# Altium schematic sheet schematics.SchDoc
size A4; SheetNumber: 1; SheetTotal: 1
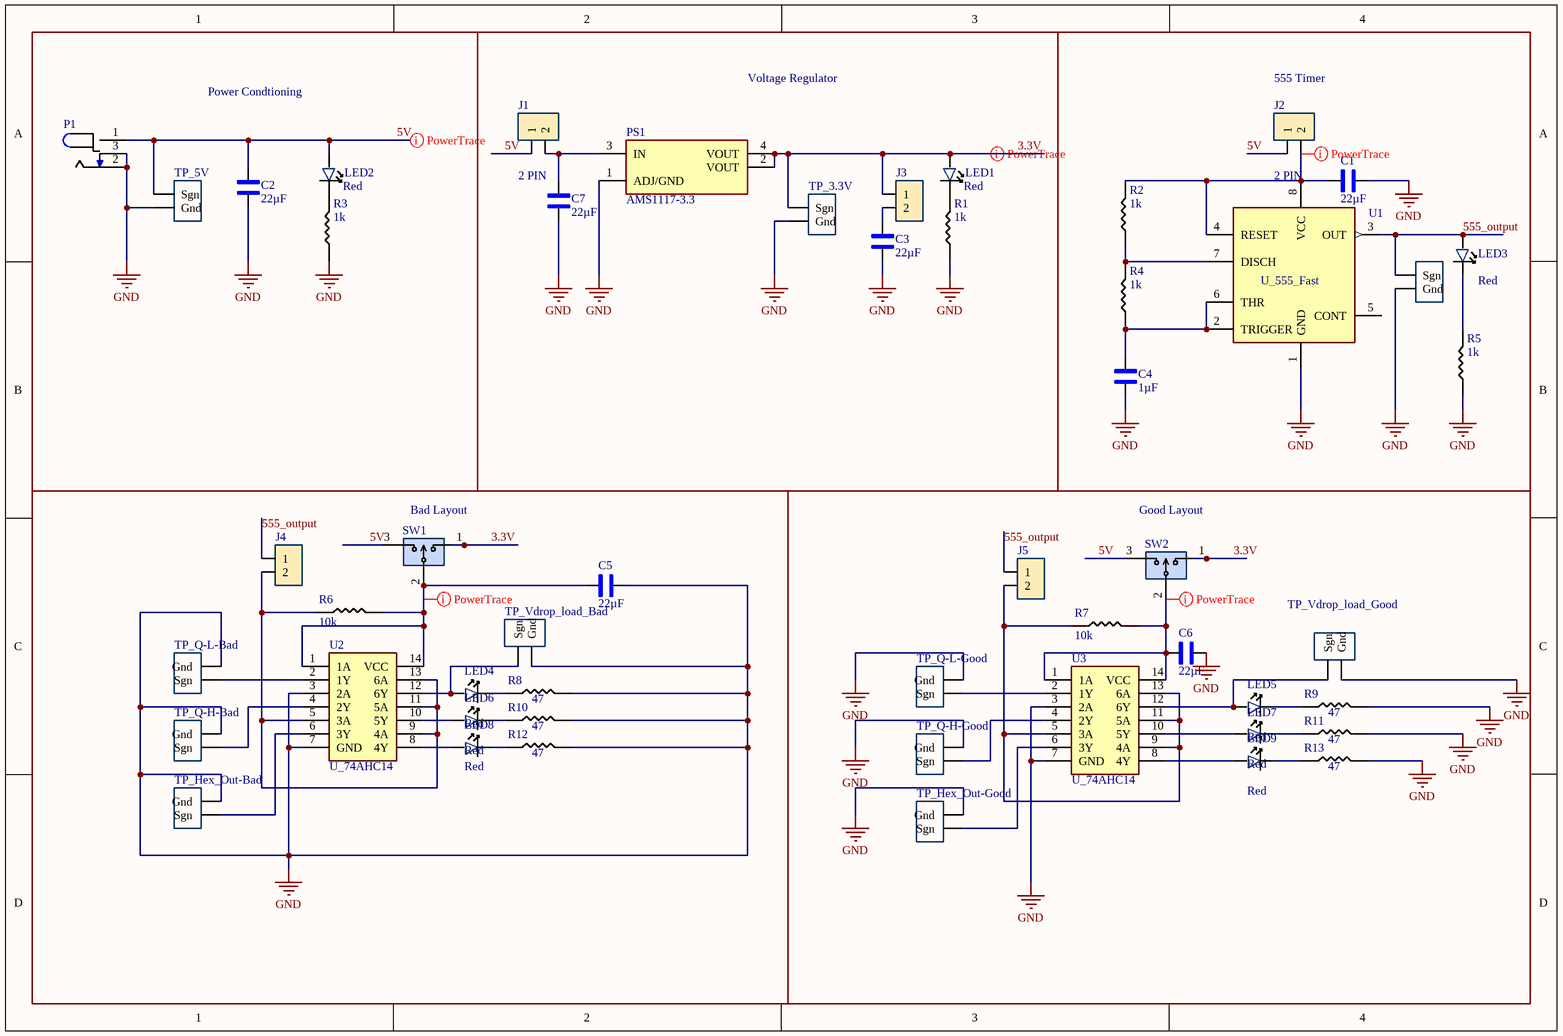
[diagram p0: schematics.SchDoc]

## Parts
C1  value 22µF  [1206_Passive_Capacitor]  (hidden comment: C_22uF_1206)
C2  value 22µF  [1206_Passive_Capacitor]  (hidden comment: C_22uF_1206)
C3  value 22µF  [1206_Passive_Capacitor]  (hidden comment: C_22uF_1206)
C4  value 1µF  [1206_Passive_Capacitor]  (hidden comment: C_1uF_1206)
C5  value 22µF  [1206_Passive_Capacitor]  (hidden comment: C_22uF_1206)
C6  value 22µF  [1206_Passive_Capacitor]  (hidden comment: C_22uF_1206)
C7  value 22µF  [1206_Passive_Capacitor]  (hidden comment: C_22uF_1206)
J1  value 2 PIN  [2_PIN_100MIL]  (hidden comment: JM_2_PIN_MALE)
J2  value 2 PIN  [2_PIN_100MIL]  (hidden comment: JM_2_PIN_MALE)
J3  JM_2_PIN_MALE  [2_PIN_100MIL]  (value not drawn)
J4  JM_2_PIN_MALE  [2_PIN_100MIL]  (value not drawn)
J5  JM_2_PIN_MALE  [2_PIN_100MIL]  (value not drawn)
LED1  value Red  [LED_1206]  (hidden comment: LED_RED_1206)
LED2  value Red  [LED_1206]  (hidden comment: LED_RED_1206)
LED3  value Red  [LED_1206]  (hidden comment: LED_RED_1206)
LED4  value Red  [LED_1206]  (hidden comment: LED_RED_1206)
LED5  value Red  [LED_1206]  (hidden comment: LED_RED_1206)
LED6  value Red  [LED_1206]  (hidden comment: LED_RED_1206)
LED7  value Red  [LED_1206]  (hidden comment: LED_RED_1206)
LED8  value Red  [LED_1206]  (hidden comment: LED_RED_1206)
LED9  value Red  [LED_1206]  (hidden comment: LED_RED_1206)
P1  P_Power Jack  [Power_Jack]  (value not drawn)
PS1  MFR Part #: AMS1117-3.3  [LDO]  (hidden comment: PS_AMS_LDO_3v3)
R1  value 1k  [1206_Passive_Resitor]  (hidden comment: R_1K_1206)
R2  value 1k  [1206_Passive_Resitor]  (hidden comment: R_1K_1206)
R3  value 1k  [1206_Passive_Resitor]  (hidden comment: R_1K_1206)
R4  value 1k  [1206_Passive_Resitor]  (hidden comment: R_1K_1206)
R5  value 1k  [1206_Passive_Resitor]  (hidden comment: R_1K_1206)
R6  value 10k  [1206_Passive_Resitor]  (hidden comment: R_10KOhm_1206)
R7  value 10k  [1206_Passive_Resitor]  (hidden comment: R_10KOhm_1206)
R8  value 47  [1206_Passive_Resitor]  (hidden comment: R_47Ohm_1206)
R9  value 47  [1206_Passive_Resitor]  (hidden comment: R_47Ohm_1206)
R10  value 47  [1206_Passive_Resitor]  (hidden comment: R_47Ohm_1206)
R11  value 47  [1206_Passive_Resitor]  (hidden comment: R_47Ohm_1206)
R12  value 47  [1206_Passive_Resitor]  (hidden comment: R_47Ohm_1206)
R13  value 47  [1206_Passive_Resitor]  (hidden comment: R_47Ohm_1206)
SW1  SW_3Pin_100mil_Switch  [3_PIN_100mil]  (value not drawn)
SW2  SW_3Pin_100mil_Switch  [3_PIN_100mil]  (value not drawn)
TP_3.3V  TP_10x_Probe  [TP10x_Probe]  (value not drawn)
TP_5V  TP_10x_Probe  [TP10x_Probe]  (value not drawn)
TP_555_output  TP_10x_Probe  [TP10x_Probe]  (value not drawn)
TP_Hex_Out-Bad  TP_10x_Probe  [TP10x_Probe]  (value not drawn)
TP_Hex_Out-Good  TP_10x_Probe  [TP10x_Probe]  (value not drawn)
TP_Q-H-Bad  TP_10x_Probe  [TP10x_Probe]  (value not drawn)
TP_Q-H-Good  TP_10x_Probe  [TP10x_Probe]  (value not drawn)
TP_Q-L-Bad  TP_10x_Probe  [TP10x_Probe]  (value not drawn)
TP_Q-L-Good  TP_10x_Probe  [TP10x_Probe]  (value not drawn)
TP_Vdrop_load_Bad  TP_10x_Probe  [TP10x_Probe]  (value not drawn)
TP_Vdrop_load_Good  TP_10x_Probe  [TP10x_Probe]  (value not drawn)
U1  U_555_Fast  [TS555IDTTR]
U2  U_74AHC14  [HEX_74AC14]
U3  U_74AHC14  [HEX_74AC14]

## Blocks framed on the sheet
Power Condtioning: C2 LED2 P1 R3 TP_5V
Voltage Regulator: C3 C7 J1 J3 LED1 PS1 R1 TP_3.3V
555 Timer: C1 C4 J2 LED3 R2 R4 R5 TP_555_output U1
Bad Layout: C5 J4 LED4 LED6 LED8 R6 R8 R10 R12 SW1 TP_Hex_Out-Bad TP_Q-H-Bad TP_Q-L-Bad TP_Vdrop_load_Bad U2
Good Layout: C6 J5 LED5 LED7 LED9 R7 R9 R11 R13 SW2 TP_Hex_Out-Good TP_Q-H-Good TP_Q-L-Good TP_Vdrop_load_Good U3

## Nets
GND: C1.2 C2.1 C3.2 C4.1 C5.1 C6.1 C7.2 P1.2 P1.3 PS1.1(ADJ/GND) R1.1 R3.1 R5.1 R8.2 R9.2 R10.2 R11.2 R12.2 R13.2 TP_3.3V.2(Gnd) TP_5V.2(Gnd) TP_555_output.2(Gnd) TP_Hex_Out-Bad.2(Gnd) TP_Hex_Out-Good.2(Gnd) TP_Q-H-Bad.2(Gnd) TP_Q-H-Good.2(Gnd) TP_Q-L-Bad.2(Gnd) TP_Q-L-Good.2(Gnd) TP_Vdrop_load_Bad.2(Gnd) TP_Vdrop_load_Good.2(Gnd) U1.1(GND) U2.3(2A) U2.7(GND) U3.3(2A) U3.7(GND)
3.3V: J3.1 LED1.1 PS1.2(VOUT) PS1.4(VOUT) SW1.1 SW2.1 TP_3.3V.1(Sgn)
5V: C2.2 J1.1 J2.1 LED2.1 P1.1 SW1.3 SW2.3 TP_5V.1(Sgn)
555_output: J4.1 J5.1 LED3.1 TP_555_output.1(Sgn) U1.3(OUT)
NetC1_1: C1.1 J2.2 R2.2 U1.4(RESET) U1.8(VCC)
NetC3_1: C3.1 J3.2
NetC4_2: C4.2 R4.1 U1.2(TRIGGER) U1.6(THR)
NetC5_2: C5.2 R6.2 SW1.2 U2.1(1A) U2.14(VCC)
NetC6_2: C6.2 R7.2 SW2.2 U3.1(1A) U3.14(VCC)
NetC7_1: C7.1 J1.2 PS1.3(IN)
NetJ4_2: J4.2 R6.1 U2.5(3A) U2.9(4A) U2.11(5A) U2.13(6A)
NetJ5_2: J5.2 R7.1 U3.5(3A) U3.9(4A) U3.11(5A) U3.13(6A)
NetLED1_2: LED1.2 R1.2
NetLED2_2: LED2.2 R3.2
NetLED3_2: LED3.2 R5.2
NetLED4_1: LED4.1 TP_Vdrop_load_Bad.1(Sgn) U2.12(6Y)
NetLED4_2: LED4.2 R8.1
NetLED5_1: LED5.1 TP_Vdrop_load_Good.1(Sgn) U3.12(6Y)
NetLED5_2: LED5.2 R9.1
NetLED6_1: LED6.1 U2.10(5Y)
NetLED6_2: LED6.2 R10.1
NetLED7_1: LED7.1 U3.10(5Y)
NetLED7_2: LED7.2 R11.1
NetLED8_1: LED8.1 U2.8(4Y)
NetLED8_2: LED8.2 R12.1
NetLED9_1: LED9.1 U3.8(4Y)
NetLED9_2: LED9.2 R13.1
NetR2_1: R2.1 R4.2 U1.7(DISCH)
NetTP_Hex_Out-Bad_1: TP_Hex_Out-Bad.1(Sgn) U2.6(3Y)
NetTP_Hex_Out-Good_1: TP_Hex_Out-Good.1(Sgn) U3.6(3Y)
NetTP_Q-H-Bad_1: TP_Q-H-Bad.1(Sgn) U2.4(2Y)
NetTP_Q-H-Good_1: TP_Q-H-Good.1(Sgn) U3.4(2Y)
NetTP_Q-L-Bad_1: TP_Q-L-Bad.1(Sgn) U2.2(1Y)
NetTP_Q-L-Good_1: TP_Q-L-Good.1(Sgn) U3.2(1Y)

Not connected (* = marked no-connect by the designer): U1 5(CONT)

## Layout directives
rule Width Constraint [Pref Width = 20mil    Min Width = 10mil    Max Width = 100mil]: 3.3V, 5V, NetC1_1, NetC5_2, NetC6_2

## Library data of the parts
C1-C3 C5-C7 = CMP-001-00089-1: 22uF ±10% 25V X5R 1206 Multilayer Ceramic Capacitors MLCC - SMD/SMT RoHS; MFR Part #: CL31A226KAHNNNE; Type: basic; Design Item ID: C_22uF_1206; Datasheet: https://datasheet.lcsc.com/lcsc/1811031514_Samsung-Electro-Mechanics-CL31A226KAHNNNE_C12891.pdf; LCSC Part#: C12891; Component Type: Standard; Pins: 2; Source: ECEN5730Lib_2023_05_DS.SchLib
C4 = CMP-001-00086-1: MULTILAYER CERAMIC CAPACITORS MLCC - SMD/SMT 1UF 50V 1206 ROHS; MFR Part #: CL31B105KBHNNNE; Type: Basic; Source: ECEN5730Lib_2023_05_DS.SchLib; Digikey Link: https://www.digikey.com/product-detail/en/C1206C105M4RACTU/399-8150-1-ND/3471873/?itemSeq=304982366; Pins: 2; Design Item ID: C_1uF_1206; LCSC Part#: C1848; Component Type: Standard
J1 J2 = CMP-002-00089-1: 2.54mm Straight 2 1 Header,Breakaway Through Hole,P=2.54mm Pin Header & Female Header ROHS; MFR Part #: B-2100S02P-A110; LCSC Part#: C124375; Source: ECEN5730Lib_2023_05_DS.SchLib; Type: Extended; Pins: 2; Datasheet: https://datasheet.lcsc.com/lcsc/1811151421_Ckmtw-Shenzhen-Cankemeng-B-2100S02P-A110_C124375.pdf; Component Type: Standard; Design Item ID: JM_2_PIN_MALE
J3-J5 = CMP-002-00089-1: 2.54mm Straight 2 1 Header,Breakaway Through Hole,P=2.54mm Pin Header & Female Header ROHS; MFR Part #: B-2100S02P-A110; Value: 2 PIN; LCSC Part#: C124375; Source: ECEN5730Lib_2023_05_DS.SchLib; Type: Extended; Pins: 2; Datasheet: https://datasheet.lcsc.com/lcsc/1811151421_Ckmtw-Shenzhen-Cankemeng-B-2100S02P-A110_C124375.pdf; Component Type: Standard; Design Item ID: JM_2_PIN_MALE
LED1-LED3 = CMP-007-00045-1: Red 621~631nm 1206 Light Emitting Diodes (LED) RoHS; MFR Part #: 15-21/R6C-FQ1R1B/2T; Type: Extended; Source: ECEN5730Lib_2023_05_DS.SchLib; LCSC Part#: C93133; Design Item ID: LED_RED_1206; Pins: 2; Component Type: Standard; Datasheet: https://datasheet.lcsc.com/szlcsc/1811151241_Everlight-Elec-15-21-R6C-FQ1R1B-2T_C93133.pdf
LED4-LED9 = CMP-007-00055-1: Red 621~631nm 1206 Light Emitting Diodes (LED) RoHS; MFR Part #: 15-21/R6C-FQ1R1B/2T; Type: Extended; Pins: 2; Design Item ID: LED_RED_1206; Datasheet: https://datasheet.lcsc.com/szlcsc/1811151241_Everlight-Elec-15-21-R6C-FQ1R1B-2T_C93133.pdf; Component Type: Standard; LCSC Part#: C93133; Source: ECEN5730Lib_2023_05_DS.SchLib
P1 = CMP-002-00097-1: Power Barrel Connector Jack 2.10mm ID (0.083"), 5.50mm OD (0.217") Through Hole, Right Angle; MFR Part #: PJ-102A; Value: CONN PWR JACK 2X5.5MM SOLDER; Component Type: Standard; LCSC Part#: C136744; Source: ECEN5730Lib_2023_05_DS.SchLib; Type: Extended; Digikey Link: https://www.digikey.com/product-detail/en/PJ-102A/CP-102A-ND/275425/?itemSeq=304982367; Pins: 3; Design Item ID: P_Power Jack
PS1 = CMP-017-000002-1: LOW DROPOUT REGULATORS(LDO) POSITIVE FIXED 1.3V @ 800MA 15V 3.3V 1A SOT-223 ROHS; Value: IC REG LINEAR 3.3V 800MA SOT223; Component Type: Standard; Source: ECEN5730Lib_2023_05_DS.SchLib; Type: Basic; Design Item ID: PS_AMS_LDO_3v3; Pin Count: 4; LCSC Part#: C6186
R1 R3 R5 = CMP-009-00194-1: CHIP RESISTOR - SURFACE MOUNT 1KOHMS ±1% 1/4W 1206 ROHS; MFR Part #: RNCP1206FTD1K00CT; LCSC Part#: C4410; Pins: 2; Source: ECEN5730Lib_2023_05_DS.SchLib; Digikey Link: https://www.digikey.com/product-detail/en/RNCP1206FTD1K00/RNCP1206FTD1K00CT-ND/2240675/?itemSeq=304982373; Type: Basic; Component Type: Standard; Design Item ID: R_1K_1206
R2 R4 = CMP-009-00231-1: CHIP RESISTOR - SURFACE MOUNT 1KOHMS ±1% 1/4W 1206 ROHS; MFR Part #: RNCP1206FTD1K00CT; Design Item ID: R_1K_1206; LCSC Part#: C4410; Pins: 2; Component Type: Standard; Source: ECEN5730Lib_2023_05_DS.SchLib; Digikey Link: https://www.digikey.com/product-detail/en/RNCP1206FTD1K00/RNCP1206FTD1K00CT-ND/2240675/?itemSeq=304982373; Type: Basic
R6 R7 = CMP-009-00223-1: 10 kOhms ±5% 0.25W, 1/4W Chip Resistor 1206 (3216 Metric) Automotive AEC-Q200 Thick Film; MFR Part #: RMCF1206FT10K0; Digikey Link: https://www.digikey.com/en/products/detail/stackpole-electronics-inc/RMCF1206FT10K0/1759669; LCSC Part#: C17902; Type: Basic; Design Item ID: R_10KOhm_1206; Source: ECEN5730Lib_2023_05_DS.SchLib; Component Type: Standard; Pins: 2
R8-R13 = CMP-009-00209-1: 47O ±5% 0.25W ±200ppm/? 1206 Chip Resistor - Surface Mount RoHS; MFR Part #: 1206W4J0470T5E; Datasheet: https://datasheet.lcsc.com/lcsc/1811101020_UNI-ROYAL-Uniroyal-Elec-1206W4J0470T5E_C25384.pdf; Type: Extended; Component Type: Standard; LCSC Part#: C25384; Source: ECEN5730Lib_2023_05_DS.SchLib; Pins: 2; Design Item ID: R_47Ohm_1206
SW1 SW2 = CMP-002-00126-1: Connector Header Through Hole 3 position 0.100" (2.54mm); MFR Part #: PREC003SAAN-RC; Value: CONN HEADER VERT 3POS 2.54MM; Type: Extended; LCSC Part#: C49257; Source: ECEN5730Lib_2023_05_DS.SchLib; Pins: 3; Design Item ID: SW_3Pin_100mil_Switch; Component Type: Standard; Digikey Link: https://www.digikey.com/product-detail/en/PREC003SAAN-RC/S1012EC-03-ND/2774851/?itemSeq=304982371
TP_3.3V TP_5V TP_555_output TP_Hex_Out-Bad TP_Hex_Out-Good TP_Q-H-Bad TP_Q-H-Good TP_Q-L-Bad TP_Q-L-Good TP_Vdrop_load_Bad TP_Vdrop_load_Good = CMP-016-000001-1: Test Point 300 mil centers; Source: ECEN5730Lib_2023_05_DS.SchLib; Design Item ID: TP_10x_Probe; Pin Count: 2; Component Type: Standard
U1 = CMP-031-00019-1: 555 Type, Timer/Oscillator _Single_ IC 3MHz 8-SO; MFR Part #: LMC555CMX/NOPB; Component Type: Standard; Case/Package: SOIC-8; LCSC Part#: C90760; Source: ECEN5730Lib_2023_05_DS.SchLib; Type: Extended; Pins: 8; Design Item ID: U_555_Fast; DigiKey link: https://www.digikey.com/product-detail/en/texas-instruments/LMC555CMX-NOPB/LMC555CMX-NOPBCT-ND/1010550
U2 U3 = CMP-031-00021-1: Inverter IC 6 Channel Schmitt Trigger 14-SOIC; MFR Part #: SN74AHC14DR; Component Type: Standard; Source: ECEN5730Lib_2023_05_DS.SchLib; Type: Extended; Pins: 14; LCSC Part#: C6942; Design Item ID: U_74AHC14; Datasheet: https://datasheet.lcsc.com/szlcsc/ON-Semicon-ON-74AC14SCX_C5482.pdf